# Altium project 风扇手柄驱动.PrjPcb
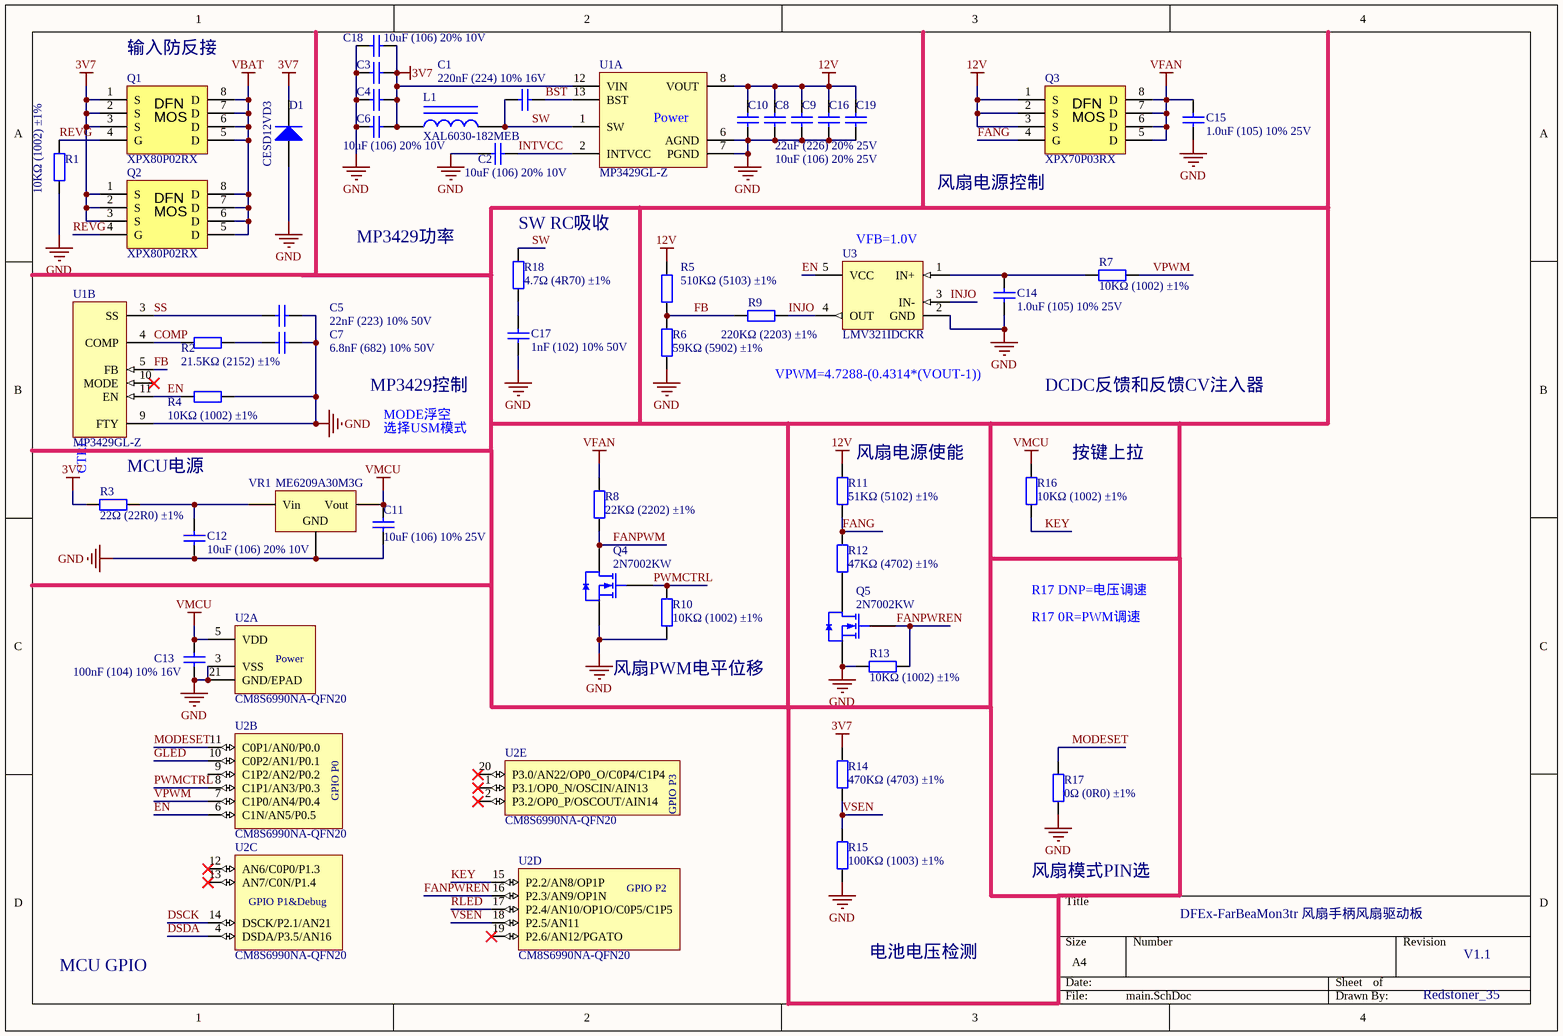
[diagram p0: main.SchDoc]
1 sheet, 48 parts. Net scope: global (net labels, ports and power ports of the same name join across sheets).
Board file: PCB2.PcbDoc

## Sheet main.SchDoc
size A4

### Parts
C1  220nF (224) 10% 16V  [0402_C]
C2  10uF (106) 20% 10V  [0402_C]
C3  47uF (476) 20% 10V  [0805_C]  (value not drawn)
C4  47uF (476) 20% 10V  [0805_C]  (value not drawn)
C5  22nF (223) 10% 50V  [0402_C]
C6  10uF (106) 20% 10V  [0402_C]
C7  6.8nF (682) 10% 50V  [0402_C]
C8  22uF (226) 20% 25V  [0805_C]  (value not drawn)
C9  22uF (226) 20% 25V  [0805_C]
C10  10uF (106) 20% 25V  [0603_C]
C11  10uF (106) 10% 25V  [0603_C]
C12  10uF (106) 20% 10V  [0402_C]
C13  100nF (104) 10% 16V  [0402_C]
C14  1.0uF (105) 10% 25V  [0402_C]
C15  1.0uF (105) 10% 25V  [0402_C]
C16  10uF (106) 20% 25V  [0603_C]  (value not drawn)
C17  1nF (102) 10% 50V  [0402_C]
C18  10uF (106) 20% 10V  [0402_C]
C19  10uF (106) 20% 25V  [0603_C]  (value not drawn)
D1  CESD12VD3  [SOD-323]
L1  XAL6030-182MEB  [XAL6030-xxxME]
Q1  XPX80P02RX  [DFN-8_L3.0-W3.0-P0.65-BL]
Q2  XPX80P02RX  [DFN-8_L3.0-W3.0-P0.65-BL]
Q3  XPX70P03RX  [DFN-8_L3.0-W3.0-P0.65-BL]
Q4  2N7002KW  [SC70-3]
Q5  2N7002KW  [SC70-3]
R1  10KΩ (1002) ±1%  [0402_R]
R2  21.5KΩ (2152) ±1%  [0402_R]
R3  22Ω (22R0) ±1%  [0402_R]
R4  10KΩ (1002) ±1%  [0402_R]
R5  510KΩ (5103) ±1%  [0402_R]
R6  59KΩ (5902) ±1%  [0402_R]
R7  10KΩ (1002) ±1%  [0402_R]
R8  22KΩ (2202) ±1%  [0402_R]
R9  220KΩ (2203) ±1%  [0402_R]
R10  10KΩ (1002) ±1%  [0402_R]
R11  51KΩ (5102) ±1%  [0402_R]
R12  47KΩ (4702) ±1%  [0402_R]
R13  10KΩ (1002) ±1%  [0402_R]
R14  470KΩ (4703) ±1%  [0402_R]
R15  100KΩ (1003) ±1%  [0402_R]
R16  10KΩ (1002) ±1%  [0402_R]
R17  0Ω (0R0) ±1%  [0402_R]
R18  4.7Ω (4R70) ±1%  [0402_R]
U1  MP3429GL-Z  [QFN-MLP3*4-13L]  (parts A,B of 2)
U2  CM8S6990NA-QFN20  [QFN40P300X300X800_HS-21N]  (parts A,B,C,D,E of 5)
U3  LMV321IDCKR  [SC70-5]
VR1  ME6209A30M3G  [SOT-23-3L]

### Nets
3V7: C3.2 C4.2 C6.2 C18.2 D1.2(K) L1.1 Q1.1(S) Q1.2(S) Q1.3(S) Q2.1(S) Q2.2(S) Q2.3(S) R3.1 R14.2 U1.12(VIN)
12V: C8.2 C9.2 C10.2 C16.2 C19.2 Q3.1(S) Q3.2(S) Q3.3(S) R5.2 R11.2 U1.8(VOUT)
GND: C2.1 C3.1 C4.1 C5.2 C6.1 C7.2 C8.1 C9.1 C10.1 C11.1 C12.1 C13.1 C14.1 C15.1 C16.1 C17.1 C18.1 C19.1 D1.1(A) Q4.2(S) Q5.2(S) R1.1 R4.1 R6.1 R10.1 R13.2 R15.1 R17.1 U1.6(AGND) U1.7(PGND) U1.9(FTY) U2.3(VSS) U2.21(GND/EPAD) U3.2(GND) VR1.1(GND)
VBAT: Q1.5(D) Q1.6(D) Q1.7(D) Q1.8(D) Q2.5(D) Q2.6(D) Q2.7(D) Q2.8(D)
VFAN: C15.2 Q3.5(D) Q3.6(D) Q3.7(D) Q3.8(D) R8.2
VMCU: C11.2 C13.2 R16.2 U2.5(VDD) VR1.2(Vout)
BST: C1.2 U1.13(BST)
COMP: R2.1 U1.4(COMP)
DSCK: U2.14(DSCK/P2.1/AN21)
DSDA: U2.4(DSDA/P3.5/AN16)
EN: R4.2 U1.11(EN) U2.6(C1N/AN5/P0.5) U3.5(VCC)
FANG: Q3.4(G) R11.1 R12.2
FANPWM: Q4.3(D) R8.1
FANPWREN: Q5.1(G) R13.1 U2.16(P2.3/AN9/OP1N)
FB: R5.1 R6.2 R9.1 U1.5(FB)
GLED: U2.10(C0P2/AN1/P0.1)
INJO: R9.2 U3.3(IN-) U3.4(OUT)
INTVCC: C2.2 U1.2(INTVCC)
KEY: R16.1 U2.15(P2.2/AN8/OP1P)
MODESET: R17.2 U2.11(C0P1/AN0/P0.0)
PWMCTRL: Q4.1(G) R10.2 U2.8(C1P1/AN3/P0.3)
REVG: Q1.4(G) Q2.4(G) R1.2
RLED: U2.17(P2.4/AN10/OP1O/C0P5/C1P5)
SS: C5.1 U1.3(SS)
SW: C1.1 L1.2 R18.2 U1.1(SW)
VPWM: R7.2 U2.7(C1P0/AN4/P0.4)
VSEN: R14.1 R15.2 U2.18(P2.5/AN11)
NetC7_1: C7.1 R2.2
NetC12_2: C12.2 R3.2 VR1.3(Vin)
NetC14_2: C14.2 R7.1 U3.1(IN+)
NetC17_2: C17.2 R18.1
NetQ5_3: Q5.3(D) R12.1

Not connected (* = marked no-connect by the designer): U1 10(MODE)*; U2 1(P3.1/OP0_N/OSCIN/AIN13)* 2(P3.2/OP0_P/OSCOUT/AIN14)* 9(C1P2/AN2/P0.2) 12(AN6/C0P0/P1.3)* 13(AN7/C0N/P1.4)* 19(P2.6/AN12/PGATO)* 20(P3.0/AN22/OP0_O/C0P4/C1P4)*

### Notes on the sheet
- (near Q1) 输入防反接
- MP3429功率
- (near R18) SW RC吸收
- (near U3) VFB=1.0V
- 风扇电源控制
- VPWM=4.7288-(0.4314*(VOUT-1))
- MP3429控制
- MODE浮空
- 选择USM模式
- DCDC反馈和反馈CV注入器
- MCU电源
- (near R11) 风扇电源使能
- (near R16) 按键上拉
- R17 DNP=电压调速
- R17 0R=PWM调速
- (near R10) 风扇PWM电平位移
- 风扇模式PIN选
- DFEx-FarBeaMon3tr 风扇手柄风扇驱动板
- MCU GPIO
- 电池电压检测
- V1.1
- Redstoner_35
- (in symbol CM8S6990NA-QFN20, part A) Power
- (in symbol CM8S6990NA-QFN20, part B) GPIO P0
- (in symbol CM8S6990NA-QFN20, part C) GPIO P1&Debug
- (in symbol CM8S6990NA-QFN20, part D) GPIO P2
- (in symbol CM8S6990NA-QFN20, part E) GPIO P3
- (in symbol MP3429GL-Z, part A) Power
- (in symbol MP3429GL-Z, part B) CTRL
- (in symbol SON/DFN5x6 MOS) DFN; MOS

### Library data of the parts
C1 = 0402 220nF (224) 10% 16V: 贴片电容; ComponentLink1Description: 供应商链接; ComponentLink1URL: http://www.szlcsc.com/product/details_17456.html; Package: 0402; Supplier: LC; SuppliersPartNumber: C16772
C2 C6 C12 C18 = 0402 10uF (106) 20% 6.3V: 贴片电容; ComponentLink1Description: 供应商链接; ComponentLink1URL: http://www.szlcsc.com/product/details_16204.html; Package: 0402; Supplier: LC; SuppliersPartNumber: C15525
C3 C4 C8 C9 = 0805 22uF (226) 20% 25V: 贴片电容; ComponentLink1Description: 供应商链接; ComponentLink1URL: http://www.szlcsc.com/product/details_46786.html; Package: 0805; Supplier: LC; SuppliersPartNumber: C45783
C5 = 0402 22nF (223) 10% 50V: 贴片电容; ComponentLink1Description: 供应商链接; ComponentLink1URL: http://www.szlcsc.com/product/details_1884.html; Package: 0402; Supplier: LC; SuppliersPartNumber: C1532
C7 = 0402 10nF (103) 10% 50V: 贴片电容; ComponentLink1Description: 供应商链接; ComponentLink1URL: http://www.szlcsc.com/product/details_15869.html; Package: 0402; Supplier: LC; SuppliersPartNumber: C15195
C10 C16 C19 = 0603 4.7uF (475) 10% 16V: 贴片电容; ComponentLink1Description: 供应商链接; ComponentLink1URL: http://www.szlcsc.com/product/details_20375.html; Package: 0603; Supplier: LC; SuppliersPartNumber: C19666
C11 = 0603 10uF (106) 10% 10V: 贴片电容; ComponentLink1Description: 供应商链接; ComponentLink1URL: http://www.szlcsc.com/product/details_20411.html; Package: 0603; Supplier: LC; SuppliersPartNumber: C19702
C13 = 0402 100nF (104) 10% 16V: 贴片电容; ComponentLink1Description: 供应商链接; ComponentLink1URL: http://www.szlcsc.com/product/details_1877.html; Package: 0402; Supplier: LC; SuppliersPartNumber: C1525
C14 C15 = 0402 1.0uF (105) 10% 25V: 贴片电容; ComponentLink1Description: 供应商链接; ComponentLink1URL: http://www.szlcsc.com/product/details_53938.html; Package: 0402; Supplier: LC; SuppliersPartNumber: C52923
C17 = 0402 1nF (102) 10% 50V: 贴片电容; ComponentLink1Description: 供应商链接; ComponentLink1URL: http://www.szlcsc.com/product/details_1875.html; Package: 0402; Supplier: LC; SuppliersPartNumber: C1523
D1 = SOD-323 1N4148WS T4: 12V TVS二极管; ComponentLink1Description: 供应商链接; ComponentLink1URL: http://www.szlcsc.com/product/details_2485.html; Package: SOD-323; Supplier: LC; SuppliersPartNumber: C2128
L1 = Inductor Iron: Magnetic-Core Inductor; Value: 1.8uH; Published: 24-Mar-1999; LatestRevisionDate: 17-Jul-2002; LatestRevisionNote: Re-released for DXP Platform.; PackageReference: AXIAL-0.9; Publisher: Altium Limited; PackageDescription: Axial Device, Thru-Hole; 2 Leads; 0.9 in Pin Spacing
Q1 Q2 = SON/DFN5x6 MOS: -20V -80A 4mR内阻 P沟道MOSFET
Q3 = SON/DFN5x6 MOS: -30V -70A 6.5mR P沟道增强型MOSFET
Q4 Q5 = 2N7002 7002: 单N沟道MOSFET(场效应管); ComponentLink1Description: 供应商链接; ComponentLink1URL: http://www.szlcsc.com/product/details_9040.html; Package: SOT-323; Supplier: LC; SuppliersPartNumber: C???????
R1 R4 R7 R10 R13 R16 = 0402 10KΩ (1002) 1%: 贴片电阻; ComponentLink1Description: 供应商链接; ComponentLink1URL: http://www.szlcsc.com/product/details_26487.html; Package: 0402; Supplier: LC; SuppliersPartNumber: C25744
R2 = 0402 18KΩ (1802) 1%: 贴片电阻; ComponentLink1Description: 供应商链接; ComponentLink1URL: http://www.szlcsc.com/product/details_26505.html; Package: 0402; Supplier: LC; SuppliersPartNumber: C25762
R3 = 0402 22Ω (22R0) 1%: 贴片电阻; ComponentLink1Description: 供应商链接; ComponentLink1URL: http://www.szlcsc.com/product/details_25835.html; Package: 0402; Supplier: LC; SuppliersPartNumber: C25092
R5 R6 = 0402 510KΩ (5103) 1%: 贴片电阻; ComponentLink1Description: 供应商链接; ComponentLink1URL: http://www.szlcsc.com/product/details_12170.html; Package: 0402; Supplier: LC; SuppliersPartNumber: C11616
R8 = 0402 22KΩ (2202) 1%: 贴片电阻; ComponentLink1Description: 供应商链接; ComponentLink1URL: http://www.szlcsc.com/product/details_26511.html; Package: 0402; Supplier: LC; SuppliersPartNumber: C25768
R9 R15 = 0402 100KΩ (1003) 1%: 贴片电阻; ComponentLink1Description: 供应商链接; ComponentLink1URL: http://www.szlcsc.com/product/details_26484.html; Package: 0402; Supplier: LC; SuppliersPartNumber: C25741
R11 = 0402 47KΩ (4702) 1%: 贴片电阻; ComponentLink1Description: 供应商链接; ComponentLink1URL: http://www.szlcsc.com/product/details_26535.html; Package: 0402; Supplier: LC; SuppliersPartNumber: C25792
R12 = 0402 51KΩ (5102) 1%: 贴片电阻; ComponentLink1Description: 供应商链接; ComponentLink1URL: http://www.szlcsc.com/product/details_26537.html; Package: 0402; Supplier: LC; SuppliersPartNumber: C25794
R14 = 0402 470KΩ (4703) 1%: 贴片电阻; ComponentLink1Description: 供应商链接; ComponentLink1URL: http://www.szlcsc.com/product/details_26533.html; Package: 0402; Supplier: LC; SuppliersPartNumber: C25790
R17 = 0402 0Ω (0R0) 1%: 贴片电阻; ComponentLink1Description: 供应商链接; ComponentLink1URL: http://www.szlcsc.com/product/details_17853.html; Package: 0402; Supplier: LC; SuppliersPartNumber: C17168
R18 = 0402 1Ω (1R00) 1%: 贴片电阻; ComponentLink1Description: 供应商链接; ComponentLink1URL: http://www.szlcsc.com/product/details_25829.html; Package: 0402; Supplier: LC; SuppliersPartNumber: C25086
U1 = MP3429GL-Z: 16VOUT, 21A Peak Current Fully Integrated Synchronous Boost Converter
U2 = CM8S6990NA-QFN20: 增强型闪存1T 8051单片机，16KB Flash 256+1K XRAM
U3 = LMV321IDCKR: CMOS超小型运算放大器，SC70-5
VR1 = SOT-23 XC6206P332MR: 低压差线性稳压(LDO)，输入耐压18V 输出3V 300mA最大电流 SOT23-3封装; ComponentLink1Description: 供应商链接; ComponentLink1URL: http://www.szlcsc.com/product/details_5896.html; Package: SOT-23; Supplier: LC; SuppliersPartNumber: C5446